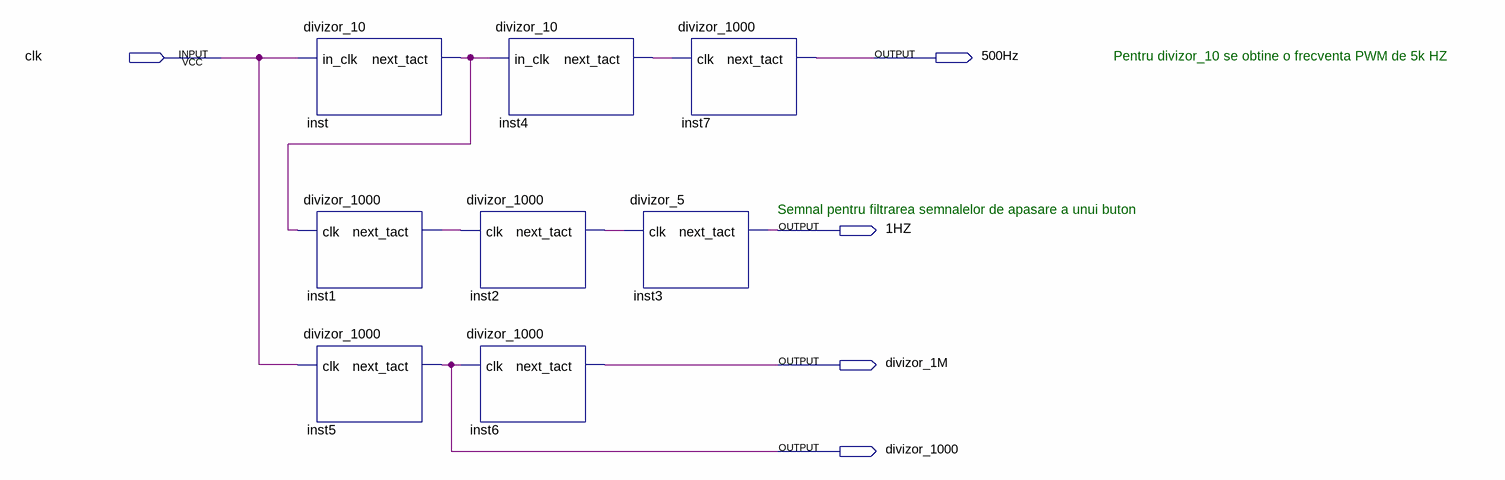
[diagram p0: schematic sheet]
// Quartus schematic divizor_frecventa.bdf as structural Verilog: 8 symbols, 5 pins
module divizor_frecventa (
  input  clk,
  output \500Hz ,
  output \1HZ ,
  output divizor_1M,
  output divizor_1000
);

  wire inst1_next_tact, inst2_next_tact, inst4_next_tact, inst_next_tact;

  divizor_10 inst (.in_clk(clk), .next_tact(inst_next_tact));
  divizor_1000 inst1 (.clk(inst_next_tact), .next_tact(inst1_next_tact));
  divizor_1000 inst5 (.clk(clk), .next_tact(divizor_1000));
  divizor_10 inst4 (.in_clk(inst_next_tact), .next_tact(inst4_next_tact));
  divizor_1000 inst2 (.clk(inst1_next_tact), .next_tact(inst2_next_tact));
  divizor_1000 inst6 (.clk(divizor_1000), .next_tact(divizor_1M));
  divizor_1000 inst7 (.clk(inst4_next_tact), .next_tact(\500Hz ));
  divizor_5 inst3 (.clk(inst2_next_tact), .next_tact(\1HZ ));

  // Notes on the sheet:
  //   Pentru divizor_10 se obtine o frecventa PWM de 5k HZ
  //   Semnal pentru filtrarea semnalelor de apasare a unui buton
endmodule
